# Altium project MB1397.PrjPcb (part 5 of 9)

## Sheet Analog Interfaces.SchDoc: Analog Interfaces
size A4; Date: Not used; ApprovedBy: Not used; CheckedBy: Not used; Author: Not used; CompanyName: STMicroelectronics; DrawnBy: Not used; Engineer: Not used; Organization: Not used; Address1: Not used; Address2: Not used; Address3: Not used; Address4: Not used; DocumentNumber: Not used; Revision: Not used; SheetNumber: 13; SheetTotal: 22; CurrentTime: Not used; CurrentDate: Not used; Time: Not used; DocumentFullPathAndName: Not used; DocumentName: Not used; ModifiedDate: Not used; ImagePath: Not used; ProjectName: Not used; Application_BuildNumber: Not used
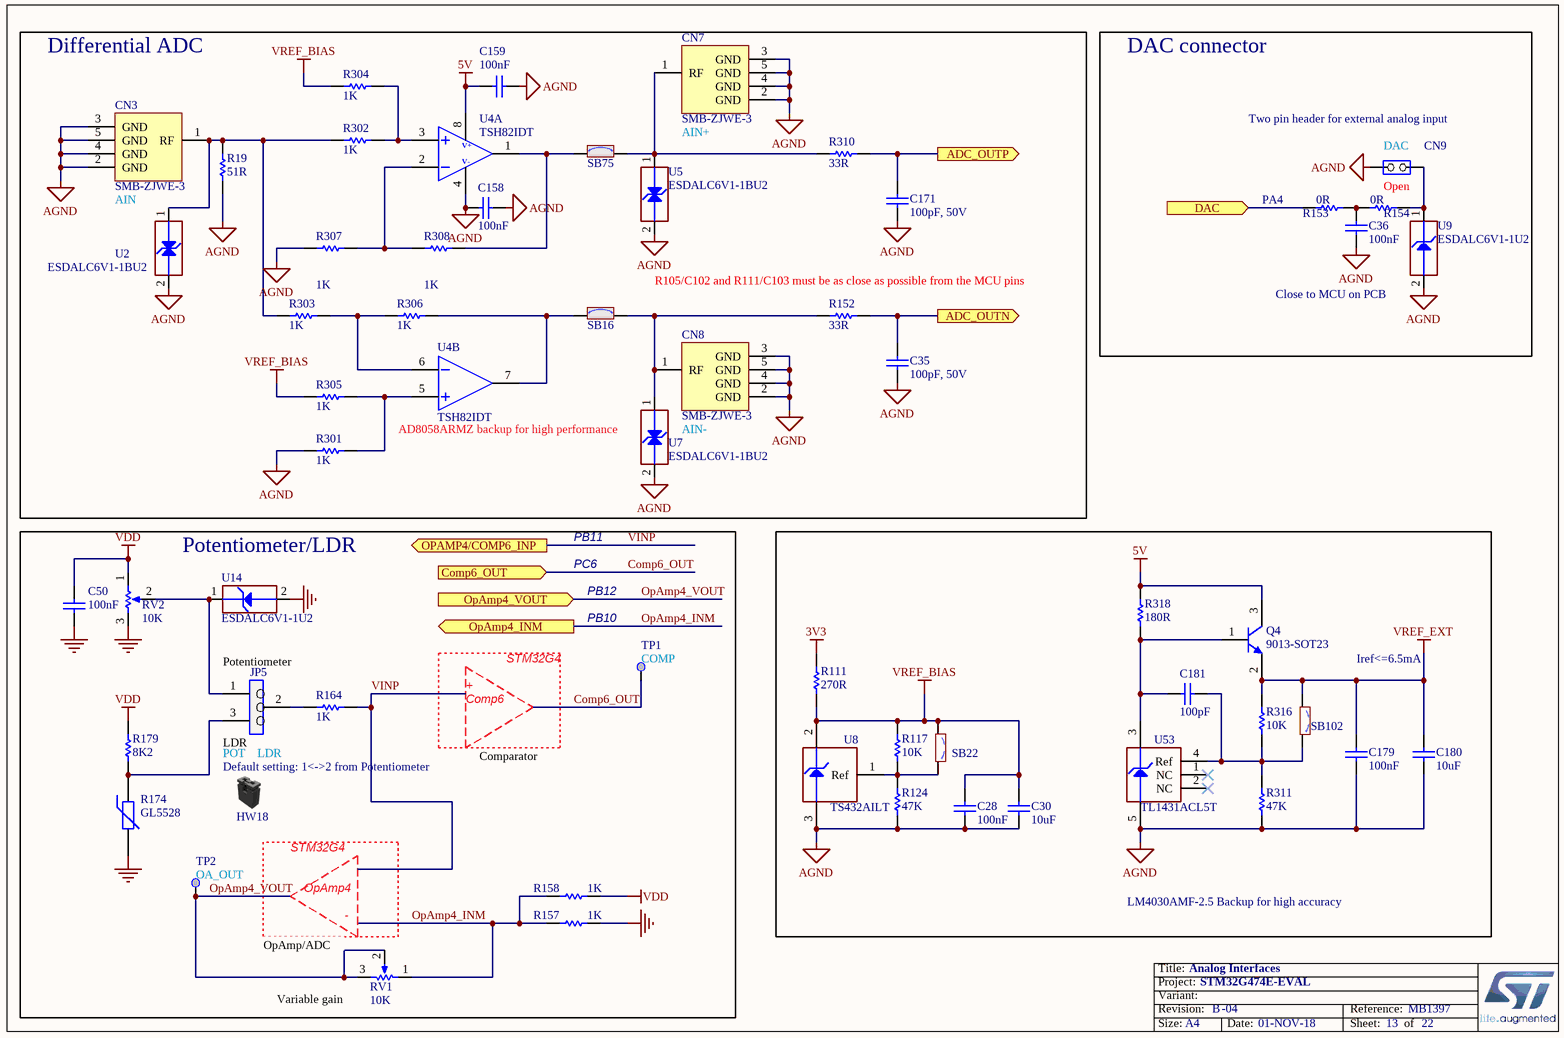
[diagram p13: Analog Interfaces.SchDoc]

### Parts
C28  value 100nF  [C0603]  (hidden comment: Capacitor)
C30  value 10uF  [C0603]  (hidden comment: Capacitor)
C35  value 100pF, 50V  [C0603]  (hidden comment: Capacitor)
C36  value 100nF  [C0603]  (hidden comment: Capacitor)
C50  value 100nF  [C0402]  (hidden comment: Capacitor)
C158  value 100nF  [C0603]  (hidden comment: Capacitor)
C159  value 100nF  [C0603]  (hidden comment: Capacitor)
C171  value 100pF, 50V  [C0603]  (hidden comment: Capacitor)
C179  value 100nF  [C0603]  (hidden comment: Capacitor)
C180  value 10uF  [C0603]  (hidden comment: Capacitor)
C181  value 100pF  [C0402]  (hidden comment: Capacitor)
CN3  SMB-ZJWE-3  [CON_JACK-RIGHT-ANGLE_YJ-ELECTRONIC_SMB-ZJWE-3]
CN7  SMB-ZJWE-3  [CON_JACK-RIGHT-ANGLE_YJ-ELECTRONIC_SMB-ZJWE-3]
CN8  SMB-ZJWE-3  [CON_JACK-RIGHT-ANGLE_YJ-ELECTRONIC_SMB-ZJWE-3]
CN9  Jumper_Header 2x1  [CON_SAMTEC_TSW-102-07-G-S]  (value not drawn)
HW18  Shunt Black 2.54mm  (value not drawn)  (mechanical)
JP5  Jumper_Header 3x1  [CON_SAMTEC_TSW-103-07-F-S]  (value not drawn)
Q4  9013-SOT23  [NPN_SOT23]
R19  value 51R  [R0603]  (hidden comment: Resistor)
R111  value 270R  [R0603]  (hidden comment: Resistor)
R117  value 10K  [R0603]  (hidden comment: Resistor)
R124  value 47K  [R0603]  (hidden comment: Resistor)
R152  value 33R  [R0603]  (hidden comment: Resistor)
R153  value 0R  [R0603]  (hidden comment: Resistor)
R154  value 0R  [R0603]  (hidden comment: Resistor)
R157  value 1K  [R0603]  (hidden comment: Resistor)
R158  value 1K  [R0603]  (hidden comment: Resistor)
R164  value 1K  [R0603]  (hidden comment: Resistor)
R174  value GL5528  [PHO_SENBAN_GL55XX]  (hidden comment: PT100)
R179  value 8K2  [R0603]  (hidden comment: Resistor)
R301  value 1K  [R0603]  (hidden comment: Resistor)
R302  value 1K  [R0603]  (hidden comment: Resistor)
R303  value 1K  [R0603]  (hidden comment: Resistor)
R304  value 1K  [R0603]  (hidden comment: Resistor)
R305  value 1K  [R0603]  (hidden comment: Resistor)
R306  value 1K  [R0603]  (hidden comment: Resistor)
R307  value 1K  [R0603]  (hidden comment: Resistor)
R308  value 1K  [R0603]  (hidden comment: Resistor)
R310  value 33R  [R0603]  (hidden comment: Resistor)
R311  value 47K  [R0603]  (hidden comment: Resistor)
R316  value 10K  [R0603]  (hidden comment: Resistor)
R318  value 180R  [R0603]  (hidden comment: Resistor)
RV1  value 10K  [POT_BOURNS_3314J-1]  (hidden comment: POTENTIOMETER)
RV2  value 10K  [POT_BOURNS_3386P]  (hidden comment: POTENTIOMETER)
SB16  SB_ON  [SOLDER-BRIDGE_R0603-0R]  (value not drawn)
SB22  SB_OFF  [SOLDER-BRIDGE_R0603-0R]  (value not drawn)
SB75  SB_ON  [SOLDER-BRIDGE_R0603-0R]  (value not drawn)
SB102  SB_OFF  [SOLDER-BRIDGE_R0603-0R]  (value not drawn)
TP1  Test Point  [TP_SMD_1MM]  (value not drawn)  (no BOM)
TP2  Test Point  [TP_SMD_1MM]  (value not drawn)  (no BOM)
U2  value ESDALC6V1-1BU2  [ESD_ST0201]  (hidden comment: ESD-TRANSIL-BIDIR)
U4  TSH82IDT  [ICC_SO8_5X4_P127]  (parts A,B of 2)
U5  value ESDALC6V1-1BU2  [ESD_ST0201]  (hidden comment: ESD-TRANSIL-BIDIR)
U7  value ESDALC6V1-1BU2  [ESD_ST0201]  (hidden comment: ESD-TRANSIL-BIDIR)
U8  TS432AILT  [ICC_SOT23-3L_H1P12]
U9  value ESDALC6V1-1U2  [ESD_ST0201]  (hidden comment: ESD-TRANSIL)
U14  value ESDALC6V1-1U2  [ESD_ST0201]  (hidden comment: ESD-TRANSIL)
U53  TL1431ACL5T  [ICC_SOT23-5L_H1P45]

### Blocks framed on the sheet
Differential ADC: C35 C158 C159 C171 CN3 CN7 CN8 R19 R152 R301-R308 R310 SB16 SB75 U2 U4 U5 U7
DAC connector: C36 CN9 R153 R154 U9
Potentiometer/LDR: C50 HW18 JP5 R157 R158 R164 R174 R179 RV1 RV2 TP1 TP2 U14

### Ports
ADC_OUTN (out), ADC_OUTP (out), Comp6_OUT (in), DAC (in), OPAMP4/COMP6_INP (out), OpAmp4_INM (out), OpAmp4_VOUT (in)

### Nets
3V3: R111.2
5V: C159.2 Q4.3(C) R318.2 U4.8
AGND: C28.1 C30.1 C35.2 C36.2 C158.1 C158.2 C159.1 C171.1 C179.1 C180.1 CN3.2(GND) CN3.3(GND) CN3.4(GND) CN3.5(GND) CN7.2(GND) CN7.3(GND) CN7.4(GND) CN7.5(GND) CN8.2(GND) CN8.3(GND) CN8.4(GND) CN8.5(GND) CN9.2(NO) R19.1 R124.1 R301.2 R307.2 R311.1 U2.2(GND) U4.4 U5.2(GND) U7.2(GND) U8.3(Anode) U9.2(GND) U53.5(Anode)
GND: C50.2 R157.2 R174.2 RV2.3(TOP) U14.2(GND)
VDD: C50.1 R158.2 R179.2 RV2.1(BOT)
VREF_BIAS: C28.2 C30.2 R111.1 R117.2 R304.1 R305.1 SB22.1 U8.2(Cathode)
VREF_EXT: C179.2 C180.2 Q4.2(E) R316.2 SB102.1
ADC_OUTN: C35.1 R152.2 ; port ADC_OUTN
Comp6_OUT: TP1.1 ; port Comp6_OUT
DAC: R153.2 ; port DAC
OpAmp4_INM: R157.1 R158.1 RV1.1(BOT) ; port OpAmp4_INM
OPAMP4_VOUT: RV1.2(TAP) RV1.3(TOP) TP2.1 ; port OpAmp4_VOUT
VINP: R164.1 ; port OPAMP4/COMP6_INP  [project net OPAMP4/COMP6_INP]
NetC36_1: C36.1 R153.1 R154.1
NetC171_2: C171.2 R310.2 ; port ADC_OUTP
NetC181_1: C181.1 R311.2 R316.1 SB102.2 U53.4(Ref)
NetC181_2: C181.2 Q4.1(B) R318.1 U53.3(Cathode)
NetCN3_1: CN3.1(RF) R19.2 R302.1 R303.2 U2.1(IO1)
NetCN7_1: CN7.1(RF) R310.1 SB75.2 U5.1(IO1)
NetCN8_1: CN8.1(RF) R152.1 SB16.2 U7.1(IO1)
NetCN9_1: CN9.1(COMMON) R154.2 U9.1(IO1)
NetJP5_1: JP5.1 RV2.2(TAP) U14.1(IO1)
NetJP5_2: JP5.2 R164.2
NetJP5_3: JP5.3 R174.1 R179.1
NetR117_1: R117.1 R124.2 SB22.2 U8.1(Ref)
NetR301_1: R301.1 R305.2 U4.5
NetR302_2: R302.2 R304.2 U4.3
NetR303_1: R303.1 R306.2 U4.6
NetR306_1: R306.1 SB16.1 U4.7
NetR307_1: R307.1 R308.2 U4.2
NetR308_1: R308.1 SB75.1 U4.1

Not connected (* = marked no-connect by the designer): U53 1(NC)* 2(NC)*

### Notes on the sheet
- AIN+
- (near CN9) Two pin header for external analog input
- (near CN9) DAC
- AIN
- (near R153) PA4
- Open
- (near R152) R105/C102 and R111/C103 must be as close as possible from the MCU pins
- Close to MCU on PCB
- AD8058ARMZ backup for high performance
- AIN-
- PB11
- PC6
- PB12
- (near TP1) PB10
- Potentiometer
- +
- Comp6
- STM32G4
- (near TP1) COMP
- Iref<=6.5mA
- (near JP5) LDR
- (near HW18) Default setting: 1<->2 from Potentiometer
- (near HW18) POT    LDR
- Comparator
- (near TP2) OA_OUT
- OpAmp4
- (near RV1) -
- LM4030AMF-2.5 Backup for high accuracy
- (near RV1) OpAmp/ADC
- (near RV1) Variable gain
- Title:
- Project:
- Size:
- Revision:
- Variant:
- A4
- Date:
- Reference:
- Sheet:
- of
- (in symbol MCD-01205, part A) V+; V-

### Library data of the parts
C28 C36 C158 C159 C179 = MCD-00211: Capacitor, MLCC, 100nF, 16V, X7R, 10%, 0603, T=0,8mm; Manufacturer_Part_Number: CC0603KRX7R7BB104; Manufacturer: YAGEO; Provided_By: SUBCO; Initial_Board_Reference: MB1319; Path: ws/MCD_ApplicationBoards/Lists/MCDPARTSdatabase; Item Type: Item; Internal_Part_Number: MCD-00211; Status: Released; Part_Type: Capacitor; Package: C0603; ComponentLink1Description: Datasheet; ComponentLink1URL: http://tunmcdsvn.tun.st.com/Component_Datasheet_Library/Trunk/Capacitors/Yageo_Multilayer_Capacitor_X7R_series_100pF_to_22uF
C30 C180 = MCD-01124: Capacitor, MLCC, 10µF, 10V, X5R, 10%, 0603, T=0.8mm; Manufacturer_Part_Number: GRM188R61A106KAAL; Manufacturer: MURATA; Provided_By: SUBCO; Initial_Board_Reference: MB1361; Path: ws/MCD_ApplicationBoards/Lists/MCDPARTSdatabase; Item Type: Item; Internal_Part_Number: MCD-01124; Status: Released; Part_Type: Capacitor; Package: C0603; ComponentLink1Description: Datasheet; ComponentLink1URL: http://tunmcdsvn.tun.st.com/Component_Datasheet_Library/Trunk/Capacitors/Murata_Capacitor_GR_series
C35 C171 = MCD-01101: Capacitor,100pF,50V,X7R,10%,0603; Manufacturer_Part_Number: 06035C101JAT4A; Manufacturer: AVX; Provided_By: SUBCO; Initial_Board_Reference: MB1381; Path: ws/MCD_ApplicationBoards/Lists/MCDPARTSdatabase; Item Type: Item; Internal_Part_Number: MCD-01101; Status: Footprint available; Part_Type: Capacitor; Package: C0603; ComponentLink1Description: Datasheet; ComponentLink1URL: http://tunmcdsvn.tun.st.com/Component_Datasheet_Library/Trunk/Capacitors/AVX_Capacitor_X7R-series/AVX_X7R-series.pdf
C50 = MCD-00006: as C33 on sheet STM32_microcontroller_power; Internal_Part_Number: MCD-00006; ComponentLink1Description: Datasheet; Status: Released; Package: C0402; Part_Type: Capacitor; ComponentLink1URL: http://tunmcdsvn.tun.st.com/Component_Datasheet_Library/Trunk/Capacitors/Yageo_Multilayer_Capacitor_X7R_series_100pF_to_22uF
C181 = MCD-00205: Capacitor, MLCC, 100pF, 50V, NPO, 5%, 0402, T=0,5mm; Manufacturer_Part_Number: CC0402JRNPO9BN101; Manufacturer: YAGEO; Provided_By: SUBCO; Initial_Board_Reference: MB1361; Path: ws/MCD_ApplicationBoards/Lists/MCDPARTSdatabase; Item Type: Item; Internal_Part_Number: MCD-00205; Status: Released; Part_Type: Capacitor; Package: C0402; ComponentLink1Description: Datasheet; ComponentLink1URL: http://tunmcdsvn.tun.st.com/Component_Datasheet_Library/Trunk/Capacitors/Yageo_Capacitor_NP0_16V-to-50V
CN3 CN7 CN8 = MCD-01181: SMB type right angle jack for PCB; Part_Type: Connector; Manufacturer: Yangzhou JingCheng Electronic Co., LTD; Provided_By: SUBCO; Initial_Board_Reference: MB1397; Remark: Please validate carefuly the pin number between schematic symbol and footprint as datasheet not mention it.; Path: ws/MCD_ApplicationBoards/Lists/MCDPARTSdatabase; Item Type: Item; Internal_Part_Number: MCD-01181; Value: SMB-ZJWE-3; Status: Checked; Manufacturer_Part_Number: SMB-ZJWE-3; ComponentLink1Description: Datasheet; ComponentLink1URL: http://tunmcdsvn.tun.st.com/Component_Datasheet_Library/Trunk/Connectors/JingCheng_SMB-ZJWE-3/
CN9 = MCD-00045: as JP8 on sheet STM32_microcontroller_power; Internal_Part_Number: MCD-00045; ComponentLink1Description: Datasheet; Status: Released; ComponentLink1URL: http://tunmcdsvn.tun.st.com/Component_Datasheet_Library/Trunk/Connectors/Samtec_TSW-HTSW-series
HW18 = MCD-00043: as HW15-HW17 on sheet STM32_microcontroller_power; Internal_Part_Number: MCD-00043; Status: Released; ComponentLink1Description: Datasheet; ComponentLink1URL: http://tunmcdsvn.tun.st.com/Component_Datasheet_Library/Trunk/Connectors/Samtec_Shunt_Jumper_SNT100
JP5 = MCD-00111: as JP6 on sheet STM32_microcontroller_power; Internal_Part_Number: MCD-00111; Value: Header 3x1; Status: Released; ComponentLink1Description: Datasheet; ComponentLink1URL: http://tunmcdsvn.tun.st.com/Component_Datasheet_Library/Trunk/Connectors/Samtec_TSW-HTSW-series
Q4 = MCD-00073: NPN Bipolar Transistor; Part_Type: IC; Manufacturer_Part_Number: BSR14; Manufacturer: NXP; Provided_By: SUBCO; Initial_Board_Reference: MB1274; Path: ws/MCD_ApplicationBoards/Lists/MCDPARTSdatabase; Item Type: Item; Revision: *; Internal_Part_Number: MCD-00073; Value: 9013-SOT23; Status: Released; ComponentLink1Description: Datasheet; ComponentLink1URL: http://tunmcdsvn.tun.st.com/Component_Datasheet_Library/Trunk/IC/NXP_Transistor_BSR14
R19 = MCD-00486: Resistor,51R,0603,1%,1/10W; Manufacturer_Part_Number: RC0603FR-0751RL; Manufacturer: YAGEO; Provided_By: SUBCO; Initial_Board_Reference: MBxxxx; Path: ws/MCD_ApplicationBoards/Lists/MCDPARTSdatabase; Item Type: Item; Internal_Part_Number: MCD-00486; Status: Released; Part_Type: Resistor; Package: R0603; ComponentLink1Description: Datasheet; ComponentLink1URL: http://tunmcdsvn.tun.st.com/Component_Datasheet_Library/Trunk/Resistors/Yageo_Resistor_RC0603-series
R111 = MCD-00442: Resistor,270R,0603,1%,1/10W; Manufacturer_Part_Number: RC0603FR-07270RL; Manufacturer: YAGEO; Provided_By: SUBCO; Initial_Board_Reference: MBxxxx; Path: ws/MCD_ApplicationBoards/Lists/MCDPARTSdatabase; Item Type: Item; Internal_Part_Number: MCD-00442; Status: Released; Part_Type: Resistor; Package: R0603; ComponentLink1Description: Datasheet; ComponentLink1URL: http://tunmcdsvn.tun.st.com/Component_Datasheet_Library/Trunk/Resistors/Yageo_Resistor_RC0603-series
R117 R316 = MCD-00220: Resistor,10K,0603,1%,1/10W; Manufacturer_Part_Number: RC0603FR-0710KL; Manufacturer: YAGEO; Provided_By: SUBCO; Initial_Board_Reference: MB1319; Path: ws/MCD_ApplicationBoards/Lists/MCDPARTSdatabase; Item Type: Item; Internal_Part_Number: MCD-00220; Status: Released; Part_Type: Resistor; Package: R0603; ComponentLink1Description: Datasheet; ComponentLink1URL: http://tunmcdsvn.tun.st.com/Component_Datasheet_Library/Trunk/Resistors/Yageo_Resistor_RC0603-series
R124 R311 = MCD-00222: Resistor,47K,0603,1%,1/10W; Manufacturer_Part_Number: RC0603FR-0747KL; Manufacturer: YAGEO; Provided_By: SUBCO; Initial_Board_Reference: MB1319; Path: ws/MCD_ApplicationBoards/Lists/MCDPARTSdatabase; Item Type: Item; Internal_Part_Number: MCD-00222; Status: Released; Part_Type: Resistor; Package: R0603; ComponentLink1Description: Datasheet; ComponentLink1URL: http://tunmcdsvn.tun.st.com/Component_Datasheet_Library/Trunk/Resistors/Yageo_Resistor_RC0603-series
R152 R310 = MCD-00456: Resistor,33R,0603,1%,1/10W; Manufacturer_Part_Number: RC0603FR-0733RL; Manufacturer: YAGEO; BMS_Part_Number: 9129732; Provided_By: SUBCO; Initial_Board_Reference: MBxxxx; Path: ws/MCD_ApplicationBoards/Lists/MCDPARTSdatabase; Item Type: Item; Internal_Part_Number: MCD-00456; Status: Released; Part_Type: Resistor; Package: R0603; ComponentLink1Description: Datasheet; ComponentLink1URL: http://tunmcdsvn.tun.st.com/Component_Datasheet_Library/Trunk/Resistors/Yageo_Resistor_RC0603-series
R153 R154 = MCD-00056: Resistor,0R,0603,5%,1/10W; Manufacturer_Part_Number: RC0603JR-070RL; Manufacturer: YAGEO; Provided_By: SUBCO; Initial_Board_Reference: MB1274; Path: ws/MCD_ApplicationBoards/Lists/MCDPARTSdatabase; Item Type: Item; Internal_Part_Number: MCD-00056; ComponentLink1Description: Datasheet; Status: Released; Part_Type: Resistor; Package: R0603; ComponentLink1URL: http://tunmcdsvn.tun.st.com/Component_Datasheet_Library/Trunk/Resistors/Yageo_Resistor_RC0603-series
R157 R158 R164 R301-R308 = MCD-00070: Resistor,1K,0603,1%,1/10W; Manufacturer_Part_Number: RC0603FR-071KL; Manufacturer: YAGEO; Provided_By: SUBCO; Initial_Board_Reference: MB1274; Path: ws/MCD_ApplicationBoards/Lists/MCDPARTSdatabase; Item Type: Item; Internal_Part_Number: MCD-00070; Status: Released; Part_Type: Resistor; Package: R0603; ComponentLink1Description: Datasheet; ComponentLink1URL: http://tunmcdsvn.tun.st.com/Component_Datasheet_Library/Trunk/Resistors/Yageo_Resistor_RC0603-series
R174 = MCD-01158: GL55 series  photoconductive cell: Light resistance 10Lux range 10-20KOhm, Dark 1MOhm; Part_Type: Misc; Manufacturer: SHENZHEN SENBAN OPTICAL & ELECTRONIC CO. LTD; Provided_By: SUBCO; Initial_Board_Reference: MB1397; Path: ws/MCD_ApplicationBoards/Lists/MCDPARTSdatabase; Item Type: Item; Internal_Part_Number: MCD-01158; Status: Released; Manufacturer_Part_Number: GL5528; ComponentLink1Description: Datasheet; ComponentLink1URL: http://tunmcdsvn.tun.st.com/Component_Datasheet_Library/Trunk/Misc/SENBAN_photoconductive_GL55xx/
R179 = MCD-00530: Resistor,8K2,0603,1%,1/10W; Manufacturer_Part_Number: RC0603FR-078K2L; Manufacturer: YAGEO; Provided_By: SUBCO; Initial_Board_Reference: MBxxxx; Path: ws/MCD_ApplicationBoards/Lists/MCDPARTSdatabase; Item Type: Item; Internal_Part_Number: MCD-00530; Status: Released; Part_Type: Resistor; Package: R0603; ComponentLink1Description: Datasheet; ComponentLink1URL: http://tunmcdsvn.tun.st.com/Component_Datasheet_Library/Trunk/Resistors/Yageo_Resistor_RC0603-series
R318 = MCD-00342: Resistor,180R,0603,1%,1/10W; Manufacturer_Part_Number: RC0603FR-07180RL; Manufacturer: YAGEO; Provided_By: SUBCO; Initial_Board_Reference: MBxxxx; Path: ws/MCD_ApplicationBoards/Lists/MCDPARTSdatabase; Item Type: Item; Internal_Part_Number: MCD-00342; Status: Released; Part_Type: Resistor; Package: R0603; ComponentLink1Description: Datasheet; ComponentLink1URL: http://tunmcdsvn.tun.st.com/Component_Datasheet_Library/Trunk/Resistors/Yageo_Resistor_RC0603-series
RV1 = MCD-01169: 4mm Square Trimming Potentiometer 10K OHM 0.25W PC PIN; Part_Type: Resistor; Manufacturer_Part_Number: 3314J-1-103; Manufacturer: BOURNS; Provided_By: SUBCO; Initial_Board_Reference: MB1397; Path: ws/MCD_ApplicationBoards/Lists/MCDPARTSdatabase; Item Type: Item; Internal_Part_Number: MCD-01169; Status: Released; ComponentLink1Description: Datasheet; ComponentLink1URL: http://tunmcdsvn.tun.st.com/Component_Datasheet_Library/Trunk/Resistors/Bourns_Potentiometer_3314_series
RV2 = MCD-00575: TRIMMER 10K OHM 0.5W PC PIN; Part_Type: Resistor; Manufacturer_Part_Number: 3386P-1-103; Manufacturer: BOURNS; Provided_By: SUBCO; Initial_Board_Reference: MB1331; Path: ws/MCD_ApplicationBoards/Lists/MCDPARTSdatabase; Item Type: Item; Internal_Part_Number: MCD-00575; Status: Released; ComponentLink1Description: Datasheet; ComponentLink1URL: http://tunmcdsvn.tun.st.com/Component_Datasheet_Library/Trunk/Resistors/Bourns_Potentiometer_3386_series
SB16 SB75 = MCD-00071: as SB31 on sheet STM32_microcontroller_power; Internal_Part_Number: MCD-00071; Status: Released; ComponentLink1Description: Datasheet; Package: SB0603; ComponentLink1URL: http://tunmcdsvn.tun.st.com/Component_Datasheet_Library/Trunk/Resistors/Yageo_Resistor_RC0603-series
SB22 SB102 = MCD-00072: as SB30 on sheet STM32_microcontroller_power; Internal_Part_Number: MCD-00072; Status: Released; ComponentLink1Description: Datasheet; Package: SB0603; ComponentLink1URL: http://tunmcdsvn.tun.st.com/Component_Datasheet_Library/Trunk/Resistors/Yageo_Resistor_RC0603-series
TP1 TP2 = MCD-00074: as TP4 on sheet Power_Board; Internal_Part_Number: MCD-00074; Provided_By: n/a; Status: Released; ComponentLink1Description: Datasheet; ComponentLink1URL: http://na; Manufacturer: n/a; Manufacturer_Part_Number: n/a
U2 U5 U7 = MCD-01242: Single-line low capacitance Transil for bidirectional ESD protection 6V1; Part_Type: Diode; Manufacturer: STMICROELECTRONICS; Provided_By: SUBCO with ST control; Initial_Board_Reference: MB1397; Path: ws/MCD_ApplicationBoards/Lists/MCDPARTSdatabase; Item Type: Item; Internal_Part_Number: MCD-01242; Status: Checked; Manufacturer_Part_Number: ESDALC6V1-1BU2; ComponentLink1Description: Datasheet; ComponentLink1URL: http://tunmcdsvn.tun.st.com/Component_Datasheet_Library/Trunk/Diodes/STM_ESD_ESDALC6V1-1BU2; Package: ST0201
U4 = MCD-01205: Wide-band Rail-to-Rail operational amplifiers with standby function; Part_Type: IC; Manufacturer: STMICROELECTRONICS; Provided_By: SUBCO with ST control; Initial_Board_Reference: MB1397; Path: ws/MCD_ApplicationBoards/Lists/MCDPARTSdatabase; Item Type: Item; Internal_Part_Number: MCD-01205; Value: TSH82IDT; Status: Checked; Manufacturer_Part_Number: TSH82IDT; Package: SO8; ComponentLink1Description: Datasheet; ComponentLink1URL: http://tunmcdsvn.tun.st.com/Component_Datasheet_Library/Trunk/IC/STM_Amp-Ops_TSH82IDT
U8 = MCD-01204: 1.24V adjustable shunt voltage reference, Precision 0.5%; Part_Type: IC; Manufacturer: STMICROELECTRONICS; Provided_By: SUBCO with ST control; Initial_Board_Reference: MB1397; Remark: PCH: schematics symbol update please to check.Eric: pin 1 and 2 isn't same for schematic and footprint. please find update SchLib on Template.; Path: ws/MCD_ApplicationBoards/Lists/MCDPARTSdatabase; Item Type: Item; Internal_Part_Number: MCD-01204; Value: TS432AILT; Status: Checked; Manufacturer_Part_Number: TS432AILT; Package: SOT23-3L; ComponentLink1Description: Datasheet; ComponentLink1URL: http://tunmcdsvn.tun.st.com/Component_Datasheet_Library/Trunk/IC/STM_voltage_reference_TS432AILT
U9 U14 = MCD-00170: as U51 on sheet STM32_microcontroller_power; Internal_Part_Number: MCD-00170; Status: Released; Manufacturer_Part_Number: ESDALC6V1-1U2; ComponentLink1Description: Datasheet; ComponentLink1URL: http://tunmcdsvn.tun.st.com/Component_Datasheet_Library/Trunk/Diodes/STM_ESD_ESDALC6V1-1U2
U53 = MCD-01157: Programmable voltage reference; Part_Type: IC; Manufacturer: STMICROELECTRONICS; Provided_By: SUBCO with ST control; Initial_Board_Reference: MB1397; Path: ws/MCD_ApplicationBoards/Lists/MCDPARTSdatabase; Item Type: Item; Internal_Part_Number: MCD-01157; Value: TL1431ACL5T; Status: Checked; Manufacturer_Part_Number: TL1431ACL5T; Package: SOT23-5L; ComponentLink1Description: Datasheet; ComponentLink1URL: http://tunmcdsvn.tun.st.com/Component_Datasheet_Library/Trunk/IC/STM_voltage_reference_TL1431ACL5T/

## Sheet Multi-Function Expander.SchDoc: Multi-Function Expander
size A3; Date: Not used; ApprovedBy: Not used; CheckedBy: Not used; Author: Not used; CompanyName: STMicroelectronics; DrawnBy: Not used; Engineer: Not used; Organization: Not used; Address1: Not used; Address2: Not used; Address3: Not used; Address4: Not used; DocumentNumber: Not used; Revision: Not used; SheetNumber: 19; SheetTotal: 22; CurrentTime: Not used; CurrentDate: Not used; Time: Not used; DocumentFullPathAndName: Not used; DocumentName: Not used; ModifiedDate: Not used; ImagePath: Not used; ProjectName: Not used; Application_BuildNumber: Not used
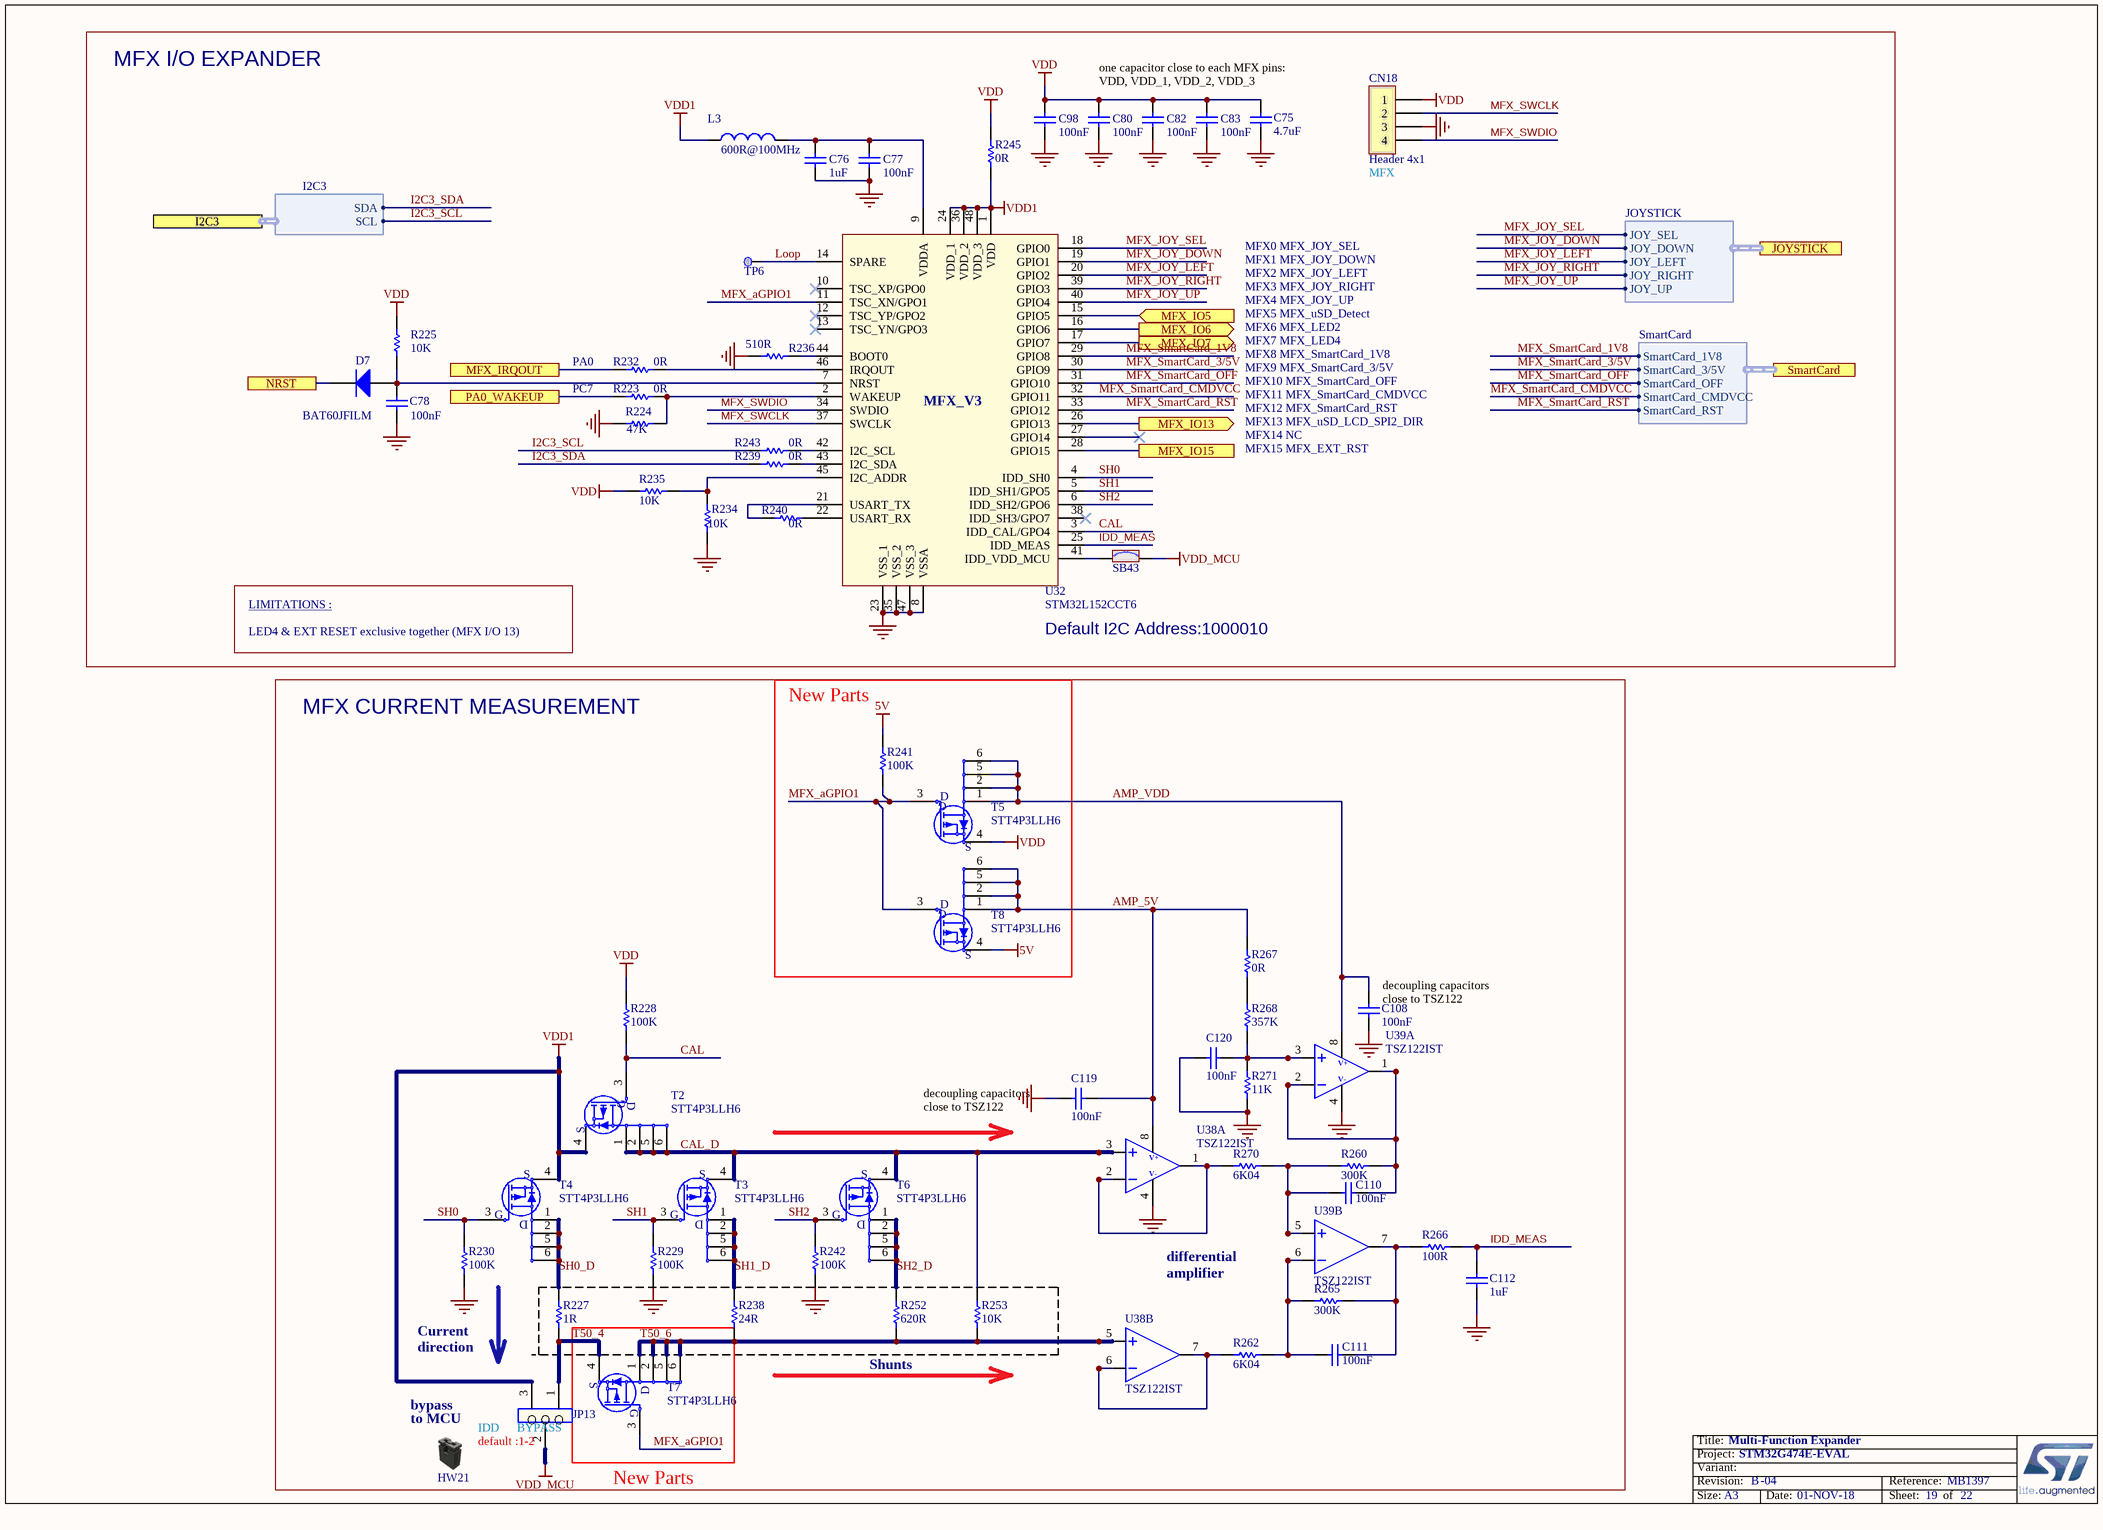
[diagram p14: Multi-Function Expander.SchDoc]

### Parts
C75  value 4.7uF  [C0603]  (hidden comment: Capacitor)
C76  value 1uF  [C0603]  (hidden comment: Capacitor)
C77  value 100nF  [C0402]  (hidden comment: Capacitor)
C78  value 100nF  [C0402]  (hidden comment: Capacitor)
C80  value 100nF  [C0402]  (hidden comment: Capacitor)
C82  value 100nF  [C0402]  (hidden comment: Capacitor)
C83  value 100nF  [C0402]  (hidden comment: Capacitor)
C98  value 100nF  [C0402]  (hidden comment: Capacitor)
C108  value 100nF  [C0603]  (hidden comment: Capacitor)
C110  value 100nF  [C0603]  (hidden comment: Capacitor)
C111  value 100nF  [C0603]  (hidden comment: Capacitor)
C112  value 1uF  [C0603]  (hidden comment: Capacitor)
C119  value 100nF  [C0603]  (hidden comment: Capacitor)
C120  value 100nF  [C0603]  (hidden comment: Capacitor)
CN18  Header 4x1  [CON_SAMTEC_TSW-104-07-G-S]
D7  BAT60JFILM  [DIO_SOD323]
HW21  Shunt Black 2.54mm  (value not drawn)  (mechanical)
JP13  Jumper_Header 3x1  [CON_SAMTEC_TSW-103-07-F-S]  (value not drawn)
L3  value 600R@100MHz  [L0603]  (hidden comment: BEAD)
R223  value 0R  [R0603]  (hidden comment: Resistor)
R224  value 47K  [R0402]  (hidden comment: Resistor)
R225  value 10K  [R0402]  (hidden comment: Resistor)
R227  value 1R  [R0805]  (hidden comment: Resistor)
R228  value 100K  [R0603]  (hidden comment: Resistor)
R229  value 100K  [R0603]  (hidden comment: Resistor)
R230  value 100K  [R0603]  (hidden comment: Resistor)
R232  value 0R  [R0603]  (hidden comment: Resistor)
R234  value 10K  [R0402]  (hidden comment: Resistor)
R235  value 10K  [R0402]  (hidden comment: Resistor)
R236  value 510R  [R0402]  (hidden comment: Resistor)
R238  value 24R  [R0805]  (hidden comment: Resistor)
R239  value 0R  [R0402]  (hidden comment: Resistor)
R240  value 0R  [R0603]  (hidden comment: Resistor)
R241  value 100K  [R0603]  (hidden comment: Resistor)
R242  value 100K  [R0603]  (hidden comment: Resistor)
R243  value 0R  [R0402]  (hidden comment: Resistor)
R245  value 0R  [R0603]  (hidden comment: Resistor)
R252  value 620R  [R0805]  (hidden comment: Resistor)
R253  value 10K  [R0805]  (hidden comment: Resistor)
R260  value 300K  [R0603]  (hidden comment: Resistor)
R262  value 6K04  [R0603]  (hidden comment: Resistor)
R265  value 300K  [R0603]  (hidden comment: Resistor)
R266  value 100R  [R0402]  (hidden comment: Resistor)
R267  value 0R  [R0603]  (hidden comment: Resistor)
R268  value 357K  [R0603]  (hidden comment: Resistor)
R270  value 6K04  [R0603]  (hidden comment: Resistor)
R271  value 11K  [R0603]  (hidden comment: Resistor)
SB43  SB_ON  [SOLDER-BRIDGE_R0603-0R]  (value not drawn)
T2  STT4P3LLH6  [MOS_SOT23-6L]
T3  STT4P3LLH6  [MOS_SOT23-6L]
T4  STT4P3LLH6  [MOS_SOT23-6L]
T5  STT4P3LLH6  [MOS_SOT23-6L]
T6  STT4P3LLH6  [MOS_SOT23-6L]
T7  STT4P3LLH6  [MOS_SOT23-6L]
T8  STT4P3LLH6  [MOS_SOT23-6L]
TP6  Test Point  [TP_SMD_1MM]  (value not drawn)  (no BOM)
U32  STM32L152CCT6  [ICC_LQFP48_7X7_P050]
U38  TSZ122IST  [ICC_MINISO8_3X3_P065]  (parts A,B of 2)
U39  TSZ122IST  [ICC_MINISO8_3X3_P065]  (parts A,B of 2)

### Blocks framed on the sheet
MFX I/O EXPANDER: C75-C78 C80 C82 C83 C98 CN18 D7 L3 R223-R225 R232 R234-R236 R239 R240 R243 R245 SB43 TP6 U32
MFX CURRENT MEASUREMENT: C108 C110-C112 C119 C120 HW21 JP13 R227-R230 R238 R242 R252 R253 R260 R262 R265-R268 R270 R271 T2-T4 T6 T7 U38 U39
New Parts: R241 T5 T8

### Ports
I2C3 (harness I2C3), JOYSTICK (harness JOYSTICK), MFX_IO5 (in), MFX_IO6 (out), MFX_IO7 (out), MFX_IO13 (out), MFX_IO15, MFX_IRQOUT, NRST, PA0_WAKEUP, SmartCard (harness SmartCard)

### Harnesses
JOYSTICK: JOY_SEL, JOY_LEFT, JOY_DOWN, JOY_RIGHT, JOY_UP
SmartCard: SmartCard_1V8, SmartCard_3/5V, SmartCard_OFF, SmartCard_CMDVCC, SmartCard_RST
I2C3: SDA, SCL

### Nets
5V: R241.2 T8.4(S)
GND: C75.1 C76.1 C77.1 C78.1 C80.1 C82.2 C83.1 C98.1 C108.1 C112.1 C119.1 C120.1 CN18.3 R224.1 R229.1 R230.1 R234.2 R236.2 R242.1 R271.1 U32.8(VSSA) U32.23(VSS_1) U32.35(VSS_2) U32.47(VSS_3) U38.4 U39.4
VDD: C75.2 C80.2 C82.1 C83.2 C98.2 CN18.1 R225.2 R228.2 R235.1 R245.2 T5.4(S)
VDD1: JP13.3 L3.1 R245.1 T2.4(S) T4.4(S) U32.1(VDD) U32.24(VDD_1) U32.36(VDD_2) U32.48(VDD_3)
VDD_MCU: JP13.2 SB43.2
AMP_5V: C119.2 R267.2 T8.1(S) T8.2(S) T8.5(D) T8.6(D) U38.8
AMP_VDD: C108.2 T5.1(S) T5.2(S) T5.5(D) T5.6(D) U39.8
CAL: R228.1 T2.3(G) U32.3(IDD_CAL/GPO4)
CAL_D: R253.2 T2.1(S) T2.2(S) T2.5(D) T2.6(D) T3.4(S) T6.4(S) U38.3
I2C3_SCL: R243.1 ; port I2C3.SCL
I2C3_SDA: R239.1 ; port I2C3.SDA
IDD_MEAS: C112.2 R266.2 U32.25(IDD_MEAS)
Loop: TP6.1 U32.14(SPARE)
MFX_aGPIO1: R241.1 T5.3(G) T7.3(G) T8.3(G) U32.11(TSC_XN/GPO1)
MFX_JOY_DOWN: U32.19(GPIO1) ; port JOYSTICK.JOY_DOWN
MFX_JOY_LEFT: U32.20(GPIO2) ; port JOYSTICK.JOY_LEFT
MFX_JOY_RIGHT: U32.39(GPIO3) ; port JOYSTICK.JOY_RIGHT
MFX_JOY_SEL: U32.18(GPIO0) ; port JOYSTICK.JOY_SEL
MFX_JOY_UP: U32.40(GPIO4) ; port JOYSTICK.JOY_UP
MFX_SmartCard_1V8: U32.29(GPIO8) ; port SmartCard.SmartCard_1V8
MFX_SmartCard_3/5V: U32.30(GPIO9) ; port SmartCard.SmartCard_3/5V
MFX_SmartCard_CMDVCC: U32.32(GPIO11) ; port SmartCard.SmartCard_CMDVCC
MFX_SmartCard_OFF: U32.31(GPIO10) ; port SmartCard.SmartCard_OFF
MFX_SmartCard_RST: U32.33(GPIO12) ; port SmartCard.SmartCard_RST
MFX_SWCLK: CN18.2 U32.37(SWCLK)
MFX_SWDIO: CN18.4 U32.34(SWDIO)
NRST: D7.2(K) ; port NRST
SH0: R230.2 T4.3(G) U32.4(IDD_SH0)
SH0_D: R227.2 T4.1(S) T4.2(S) T4.5(D) T4.6(D)
SH1: R229.2 T3.3(G) U32.5(IDD_SH1/GPO5)
SH1_D: R238.2 T3.1(S) T3.2(S) T3.5(D) T3.6(D)
SH2: R242.2 T6.3(G) U32.6(IDD_SH2/GPO6)
SH2_D: R252.2 T6.1(S) T6.2(S) T6.5(D) T6.6(D)
T50_4: JP13.1 R227.1 T7.4(S)
T50_6: R238.1 R252.1 R253.1 T7.1(S) T7.2(S) T7.5(D) T7.6(D) U38.5
NetC76_2: C76.2 C77.2 L3.2 U32.9(VDDA)
NetC78_2: C78.2 D7.1(A) R225.1 U32.7(NRST)
NetC110_1: C110.1 R260.1 R270.2 U39.5
NetC110_2: C110.2 R260.2 U39.1 U39.2
NetC111_1: C111.1 R262.2 R265.1 U39.6
NetC111_2: C111.2 R265.2 R266.1 U39.7
NetC120_2: C120.2 R268.1 R271.2 U39.3
NetR223_1: R223.1 R224.2 U32.2(WAKEUP)
NetR223_2: R223.2 ; port PA0_WAKEUP
NetR232_1: R232.1 ; port MFX_IRQOUT
NetR232_2: R232.2 U32.46(IRQOUT)
NetR234_1: R234.1 R235.2 U32.45(I2C_ADDR)
NetR236_1: R236.1 U32.44(BOOT0)
NetR239_2: R239.2 U32.43(I2C_SDA)
NetR240_1: R240.1 U32.21(USART_TX)
NetR240_2: R240.2 U32.22(USART_RX)
NetR243_2: R243.2 U32.42(I2C_SCL)
NetR262_1: R262.1 U38.6 U38.7
NetR267_1: R267.1 R268.2
NetR270_1: R270.1 U38.1 U38.2
NetSB43_1: SB43.1 U32.41(IDD_VDD_MCU)
NetU32_15: U32.15(GPIO5) ; port MFX_IO5
NetU32_16: U32.16(GPIO6) ; port MFX_IO6
NetU32_17: U32.17(GPIO7) ; port MFX_IO7
NetU32_26: U32.26(GPIO13) ; port MFX_IO13
NetU32_28: U32.28(GPIO15) ; port MFX_IO15

Not connected (* = marked no-connect by the designer): U32 10(TSC_XP/GPO0)* 12(TSC_YP/GPO2)* 13(TSC_YN/GPO3)* 27(GPIO14)* 38(IDD_SH3/GPO7)*

### Notes on the sheet
- one capacitor close to each MFX pins: VDD, VDD_1, VDD_2, VDD_3
- (near CN18) MFX
- PA0
- PC7
- MFX0	MFX_JOY_SEL
  MFX1	MFX_JOY_DOWN
  MFX2	MFX_JOY_LEFT
  MFX3	MFX_JOY_RIGHT
  MFX4	MFX_JOY_UP
  MFX5	MFX_uSD_Detect
  MFX6	MFX_LED2
  MFX7	MFX_LED4
  MFX8	MFX_SmartCard_1V8
  MFX9	MFX_SmartCard_3/5V
  MFX10	MFX_SmartCard_OFF
  MFX11	MFX_SmartCard_CMDVCC
  MFX12	MFX_SmartCard_RST
  MFX13	MFX_uSD_LCD_SPI2_DIR
  MFX14	NC
  MFX15	MFX_EXT_RST
- LIMITATIONS :
- LED4 & EXT RESET exclusive together (MFX I/O 13)
- (near U32) Default I2C Address:1000010
- (near C108) decoupling capacitors
  close to TSZ122
- (near C119) decoupling capacitors
  close to TSZ122
- differential
  amplifier
- Current direction
- Shunts
- (near HW21) to MCU
- (near HW21) bypass
- (near JP13) IDD      BYPASS
- (near JP13) default :1-2
- New Parts
- Title:
- Project:
- Size:
- Revision:
- Variant:
- A3
- -
- Date:
- Reference:
- Sheet:
- of
- (in symbol MCD-00135) MFX_V3
- (in symbol MCD-00325, part A) V+; V-

### Library data of the parts
C75 = MCD-00009: as C163 on sheet STM32_microcontroller_power; Internal_Part_Number: MCD-00009; Status: Released; Part_Type: Capacitor; Package: C0603; ComponentLink1Description: Datasheet; ComponentLink1URL: http://tunmcdsvn.tun.st.com/Component_Datasheet_Library/Trunk/Capacitors/Yageo_Multilayer_capacitor_X5R_series_100pF_to_100uF
C76 C112 = MCD-00010: as C167 on sheet STM32_microcontroller_power; Internal_Part_Number: MCD-00010; Status: Released; Package: C0603; ComponentLink1Description: Datasheet; Part_Type: Capacitor; ComponentLink1URL: http://tunmcdsvn.tun.st.com/Component_Datasheet_Library/Trunk/Capacitors/Yageo_Multilayer_capacitor_X5R_series_100pF_to_100uF
C77 C78 C80 C82 C83 C98 = MCD-00006: as C33 on sheet STM32_microcontroller_power; Internal_Part_Number: MCD-00006; ComponentLink1Description: Datasheet; Status: Released; Package: C0402; Part_Type: Capacitor; ComponentLink1URL: http://tunmcdsvn.tun.st.com/Component_Datasheet_Library/Trunk/Capacitors/Yageo_Multilayer_Capacitor_X7R_series_100pF_to_22uF
C108 C110 C111 C119 C120 = MCD-00211: as C28 on sheet Analog Interfaces; Internal_Part_Number: MCD-00211; Status: Released; Part_Type: Capacitor; Package: C0603; ComponentLink1Description: Datasheet; ComponentLink1URL: http://tunmcdsvn.tun.st.com/Component_Datasheet_Library/Trunk/Capacitors/Yageo_Multilayer_Capacitor_X7R_series_100pF_to_22uF
CN18 = MCD-00029: Header, 4x1, 2,54mm, VR, TH, Height 5.84mm/2.54mm; Manufacturer_Part_Number: TSW-104-07-x-S; Manufacturer: SAMTEC; Part_Type: Connector; Provided_By: SUBCO; Initial_Board_Reference: MB1274; Path: ws/MCD_ApplicationBoards/Lists/MCDPARTSdatabase; Item Type: Item; Internal_Part_Number: MCD-00029; Value: Header 4x1; Status: Released; ComponentLink1Description: Datasheet; ComponentLink1URL: http://tunmcdsvn.tun.st.com/Component_Datasheet_Library/Trunk/Connectors/Samtec_TSW-HTSW-series
D7 = MCD-00034: as D2 on sheet STM32_microcontroller_power; Internal_Part_Number: MCD-00034; Value: BAT60JFILM; Manufacturer_Part_Number: BAT60JFILM; ComponentLink1Description: Datasheet; Status: Released; ComponentLink1URL: http://tunmcdsvn.tun.st.com/Component_Datasheet_Library/Trunk/Diodes/STM_Diode_BAT60JFILM-SOD323
HW21 = MCD-00043: as HW15-HW17 on sheet STM32_microcontroller_power; Internal_Part_Number: MCD-00043; Status: Released; ComponentLink1Description: Datasheet; ComponentLink1URL: http://tunmcdsvn.tun.st.com/Component_Datasheet_Library/Trunk/Connectors/Samtec_Shunt_Jumper_SNT100
JP13 = MCD-00111: as JP6 on sheet STM32_microcontroller_power; Internal_Part_Number: MCD-00111; Value: Header 3x1; Status: Released; ComponentLink1Description: Datasheet; ComponentLink1URL: http://tunmcdsvn.tun.st.com/Component_Datasheet_Library/Trunk/Connectors/Samtec_TSW-HTSW-series
L3 = MCD-00047: as L1 on sheet STM32_microcontroller_power; Internal_Part_Number: MCD-00047; Status: Released; ComponentLink1Description: Datasheet; ComponentLink1URL: http://tunmcdsvn.tun.st.com/Component_Datasheet_Library/Trunk/Inductors/TaiTech_Bead_FCM1608_series
R223 R232 R240 R245 R267 = MCD-00056: as R153 on sheet Analog Interfaces; Internal_Part_Number: MCD-00056; ComponentLink1Description: Datasheet; Status: Released; Part_Type: Resistor; Package: R0603; ComponentLink1URL: http://tunmcdsvn.tun.st.com/Component_Datasheet_Library/Trunk/Resistors/Yageo_Resistor_RC0603-series
R224 = MCD-00063: Resistor,47K,0402,1%,1/16W; Manufacturer_Part_Number: RC0402FR-0747KL; Manufacturer: YAGEO; Provided_By: SUBCO; Initial_Board_Reference: MB1274; Path: ws/MCD_ApplicationBoards/Lists/MCDPARTSdatabase; Item Type: Item; Internal_Part_Number: MCD-00063; ComponentLink1Description: Datasheet; Status: Released; Part_Type: Resistor; Package: R0402; ComponentLink1URL: http://tunmcdsvn.tun.st.com/Component_Datasheet_Library/Trunk/Resistors/Yageo_Resistor_RC0402-series
R225 R234 R235 = MCD-00053: as R182 on sheet STM32_microcontroller_power; Internal_Part_Number: MCD-00053; ComponentLink1Description: Datasheet; Status: Released; Part_Type: Resistor; Package: R0402; ComponentLink1URL: http://tunmcdsvn.tun.st.com/Component_Datasheet_Library/Trunk/Resistors/Yageo_Resistor_RC0402-series
R227 = MCD-00323: Resistor, 1R, 0805, 1%, 1/8W; Manufacturer_Part_Number: RC0805FR-071RL; Manufacturer: YAGEO; Provided_By: SUBCO; Initial_Board_Reference: MB1311; Path: ws/MCD_ApplicationBoards/Lists/MCDPARTSdatabase; Item Type: Item; Internal_Part_Number: MCD-00323; Status: Released; Part_Type: Resistor; Package: R0805; ComponentLink1Description: Datasheet; ComponentLink1URL: http://tunmcdsvn.tun.st.com/Component_Datasheet_Library/Trunk/Resistors/Yageo_Resistor_RC0805-series
R228-R230 R241 R242 = MCD-00223: Resistor,100K,0603,1%,1/10W; Manufacturer_Part_Number: RC0603FR-07100KL; Manufacturer: YAGEO; Provided_By: SUBCO; Initial_Board_Reference: MB1319; Path: ws/MCD_ApplicationBoards/Lists/MCDPARTSdatabase; Item Type: Item; Internal_Part_Number: MCD-00223; Status: Released; Part_Type: Resistor; Package: R0603; ComponentLink1Description: Datasheet; ComponentLink1URL: http://tunmcdsvn.tun.st.com/Component_Datasheet_Library/Trunk/Resistors/Yageo_Resistor_RC0603-series
R236 = MCD-00064: Resistor,510R,0402,1%,1/16W; Manufacturer_Part_Number: RC0402FR-07510RL; Manufacturer: YAGEO; Provided_By: SUBCO; Initial_Board_Reference: MB1274; Path: ws/MCD_ApplicationBoards/Lists/MCDPARTSdatabase; Item Type: Item; Internal_Part_Number: MCD-00064; ComponentLink1Description: Datasheet; Status: Released; Part_Type: Resistor; Package: R0402; ComponentLink1URL: http://tunmcdsvn.tun.st.com/Component_Datasheet_Library/Trunk/Resistors/Yageo_Resistor_RC0402-series
R238 = MCD-01152: Resistor,24R,0805,1%,1/8W; Manufacturer_Part_Number: RC0805FR-0724RL; Manufacturer: YAGEO; Provided_By: SUBCO; Initial_Board_Reference: MB1372; Path: ws/MCD_ApplicationBoards/Lists/MCDPARTSdatabase; Item Type: Item; Internal_Part_Number: MCD-01152; Status: Released; Part_Type: Resistor; Package: R0805; ComponentLink1Description: Datasheet; ComponentLink1URL: http://tunmcdsvn.tun.st.com/Component_Datasheet_Library/Trunk/Resistors/Yageo_Resistor_RC0805-series/Yageo_Resistor_RC0805-series.pdf
R239 R243 = MCD-00052: as R313-R315 on sheet STM32_microcontroller_power; Internal_Part_Number: MCD-00052; Status: Released; Part_Type: Resistor; Package: R0402; ComponentLink1Description: Datasheet; ComponentLink1URL: http://tunmcdsvn.tun.st.com/Component_Datasheet_Library/Trunk/Resistors/Yageo_Resistor_RC0402-series
R252 = MCD-01153: Resistor,620R,0805,1%,1/8W; Manufacturer_Part_Number: RC0805FR-07620RL; Manufacturer: YAGEO; Provided_By: SUBCO; Initial_Board_Reference: MB1372; Path: ws/MCD_ApplicationBoards/Lists/MCDPARTSdatabase; Item Type: Item; Internal_Part_Number: MCD-01153; Status: Released; Part_Type: Resistor; Package: R0805; ComponentLink1Description: Datasheet; ComponentLink1URL: http://tunmcdsvn.tun.st.com/Component_Datasheet_Library/Trunk/Resistors/Yageo_Resistor_RC0805-series/Yageo_Resistor_RC0805-series.pdf
R253 = MCD-01154: Resistor,10K,0805,1%,1/8W; Manufacturer_Part_Number: RC0805FR-0710KL; Manufacturer: YAGEO; Provided_By: SUBCO; Initial_Board_Reference: MB1372; Path: ws/MCD_ApplicationBoards/Lists/MCDPARTSdatabase; Item Type: Item; Internal_Part_Number: MCD-01154; Status: Released; Part_Type: Resistor; Package: R0805; ComponentLink1Description: Datasheet; ComponentLink1URL: http://tunmcdsvn.tun.st.com/Component_Datasheet_Library/Trunk/Resistors/Yageo_Resistor_RC0805-series
R260 R265 = MCD-00454: Resistor,300K,0603,1%,1/10W; Manufacturer_Part_Number: RC0603FR-07300KL; Manufacturer: YAGEO; Provided_By: SUBCO; Initial_Board_Reference: MBxxxx; Path: ws/MCD_ApplicationBoards/Lists/MCDPARTSdatabase; Item Type: Item; Internal_Part_Number: MCD-00454; Status: Released; Part_Type: Resistor; Package: R0603; ComponentLink1Description: Datasheet; ComponentLink1URL: http://tunmcdsvn.tun.st.com/Component_Datasheet_Library/Trunk/Resistors/Yageo_Resistor_RC0603-series
R262 R270 = MCD-01151: Resistor,6K04,0603,1%,1/10W; Manufacturer_Part_Number: RC0603FR-076K04L; Manufacturer: YAGEO; Provided_By: SUBCO; Initial_Board_Reference: MB1372; Path: ws/MCD_ApplicationBoards/Lists/MCDPARTSdatabase; Item Type: Item; Internal_Part_Number: MCD-01151; Status: Released; Part_Type: Resistor; Package: R0603; ComponentLink1Description: Datasheet; ComponentLink1URL: http://tunmcdsvn.tun.st.com/Component_Datasheet_Library/Trunk/Resistors/Yageo_Resistor_RC0603-series
R266 = MCD-00119: as R312 on sheet STM32_microcontroller_power; Internal_Part_Number: MCD-00119; Status: Released; Part_Type: Resistor; Package: R0402; ComponentLink1Description: Datasheet; ComponentLink1URL: http://tunmcdsvn.tun.st.com/Component_Datasheet_Library/Trunk/Resistors/Yageo_Resistor_RC0402-series
R268 = MCD-01150: Resistor,357K,0603,1%,1/10W; Manufacturer_Part_Number: RC0603FR-07357KL; Manufacturer: YAGEO; Provided_By: SUBCO; Initial_Board_Reference: MB1372; Path: ws/MCD_ApplicationBoards/Lists/MCDPARTSdatabase; Item Type: Item; Internal_Part_Number: MCD-01150; Status: Released; Part_Type: Resistor; Package: R0603; ComponentLink1Description: Datasheet; ComponentLink1URL: http://tunmcdsvn.tun.st.com/Component_Datasheet_Library/Trunk/Resistors/Yageo_Resistor_RC0603-series
R271 = MCD-00366: Resistor,11K,0603,1%,1/10W; Manufacturer_Part_Number: RC0603FR-0711KL; Manufacturer: YAGEO; Provided_By: SUBCO; Initial_Board_Reference: MBxxxx; Path: ws/MCD_ApplicationBoards/Lists/MCDPARTSdatabase; Item Type: Item; Internal_Part_Number: MCD-00366; Status: Released; Part_Type: Resistor; Package: R0603; ComponentLink1Description: Datasheet; ComponentLink1URL: http://tunmcdsvn.tun.st.com/Component_Datasheet_Library/Trunk/Resistors/Yageo_Resistor_RC0603-series
SB43 = MCD-00071: as SB31 on sheet STM32_microcontroller_power; Internal_Part_Number: MCD-00071; Status: Released; ComponentLink1Description: Datasheet; Package: SB0603; ComponentLink1URL: http://tunmcdsvn.tun.st.com/Component_Datasheet_Library/Trunk/Resistors/Yageo_Resistor_RC0603-series
T2-T8 = MCD-00574: Power MOSFET - P-Channel 30 V, 0.048 ? typ., 4 A STripFET H6 DeepGATE - SOT23-6L; Part_Type: IC; Manufacturer: STMICROELECTRONICS; Alternate_Manufacturer_Part_Number: STT7P2UH7; BMS_Part_Number: 9153046; Provided_By: SUBCO with ST control; Internal_Part_Number: MCD-00574; Value: STT4P3LLH6; Status: Footprint available; Manufacturer_Part_Number: STT4P3LLH6; Alternate_Manufacturer: STMICROELECTRONICS; ComponentLink1Description: Datasheet; ComponentLink1URL: http://tunmcdsvn.tun.st.com/Component_Datasheet_Library/Trunk/IC/STM_POWER_MOSFET_STT4P3LLH6
TP6 = MCD-00074: as TP4 on sheet Power_Board; Internal_Part_Number: MCD-00074; Provided_By: n/a; Status: Released; ComponentLink1Description: Datasheet; ComponentLink1URL: http://na; Manufacturer: n/a; Manufacturer_Part_Number: n/a
U32 = MCD-00135: Ultra-low-power 32-bit MCU ARM; Manufacturer: STMICROELECTRONICS; Part_Type: IC; Provided_By: SUBCO with ST control; Initial_Board_Reference: MB1262; Path: ws/MCD_ApplicationBoards/Lists/MCDPARTSdatabase; Item Type: Item; Internal_Part_Number: MCD-00135; Value: STM32L152CCT6; Status: Released; Manufacturer_Part_Number: STM32L152CCT6; ComponentLink1Description: Datasheet; ComponentLink1URL: http://tunmcdsvn.tun.st.com/Component_Datasheet_Library/Trunk/IC/STM_MFX_STM32L152CCT6_LQFP48
U38 U39 = MCD-00325: Very high accuracy (5 µV) zero drift micropower 5 V operational amplifiers; Part_Type: IC; Manufacturer: STMICROELECTRONICS; BMS_Part_Number: 9177443; Provided_By: SUBCO with ST control; Initial_Board_Reference: MB1311; Path: ws/MCD_ApplicationBoards/Lists/MCDPARTSdatabase; Item Type: Item; Internal_Part_Number: MCD-00325; Value: TSZ122IST; Status: Released; Manufacturer_Part_Number: TSZ122IST; ComponentLink1Description: Datasheet; ComponentLink1URL: http://tunmcdsvn.tun.st.com/Component_Datasheet_Library/Trunk/IC/STM_Amp-Ops_TSZ122IST; Package: MiniSO8